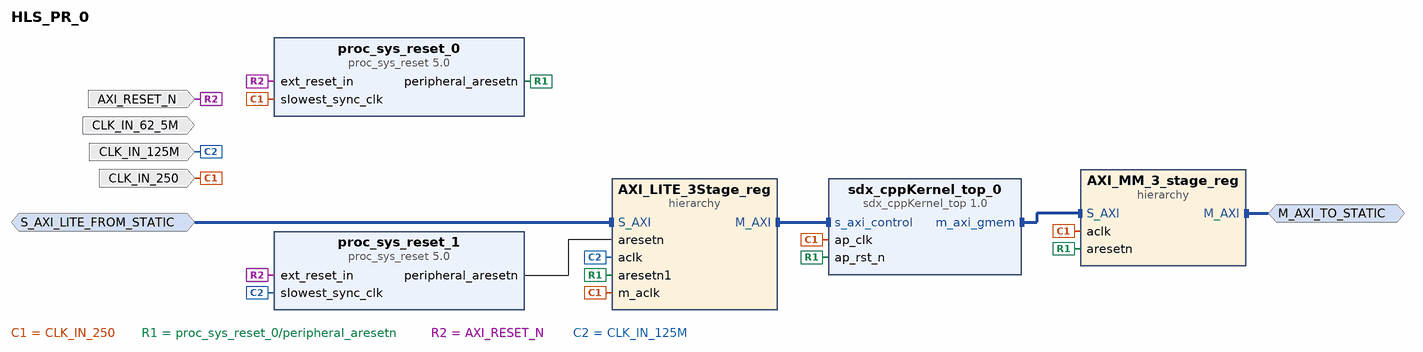
[diagram p0: block diagram of the top level]
# Vivado block design HLS_PR_0, xcvu9p-flgb2104-2-i, Vivado 2017.1_sdx
create_bd_design HLS_PR_0

create_bd_intf_port -mode Slave -vlnv xilinx.com:interface:aximm_rtl:1.0 S_AXI_LITE_FROM_STATIC
set_property -dict [list \
  CONFIG.DATA_WIDTH 32 \
  CONFIG.PROTOCOL AXI4LITE \
  CONFIG.FREQ_HZ 250000000 \
  CONFIG.ID_WIDTH 0 \
  CONFIG.ADDR_WIDTH 32 \
  CONFIG.AWUSER_WIDTH 0 \
  CONFIG.ARUSER_WIDTH 0 \
  CONFIG.WUSER_WIDTH 0 \
  CONFIG.RUSER_WIDTH 0 \
  CONFIG.BUSER_WIDTH 0 \
  CONFIG.READ_WRITE_MODE READ_WRITE \
  CONFIG.HAS_BURST 0 \
  CONFIG.HAS_LOCK 0 \
  CONFIG.HAS_PROT 1 \
  CONFIG.HAS_CACHE 0 \
  CONFIG.HAS_QOS 0 \
  CONFIG.HAS_REGION 0 \
  CONFIG.HAS_WSTRB 1 \
  CONFIG.HAS_BRESP 1 \
  CONFIG.HAS_RRESP 1 \
  CONFIG.SUPPORTS_NARROW_BURST 0 \
  CONFIG.NUM_READ_OUTSTANDING 1 \
  CONFIG.NUM_WRITE_OUTSTANDING 1 \
  CONFIG.MAX_BURST_LENGTH 1 \
  CONFIG.CLK_DOMAIN PCIe_Bridge_ICAP_complex_xdma_0_0_axi_aclk \
  CONFIG.NUM_READ_THREADS 1 \
  CONFIG.NUM_WRITE_THREADS 1 \
  CONFIG.RUSER_BITS_PER_BYTE 0 \
  CONFIG.WUSER_BITS_PER_BYTE 0 \
] [get_bd_intf_ports S_AXI_LITE_FROM_STATIC]
create_bd_intf_port -mode Master -vlnv xilinx.com:interface:aximm_rtl:1.0 M_AXI_TO_STATIC
set_property -dict [list \
  CONFIG.DATA_WIDTH 512 \
  CONFIG.PROTOCOL AXI4 \
  CONFIG.FREQ_HZ 250000000 \
  CONFIG.ADDR_WIDTH 32 \
  CONFIG.CLK_DOMAIN PCIe_Bridge_ICAP_complex_xdma_0_0_axi_aclk \
] [get_bd_intf_ports M_AXI_TO_STATIC]
create_bd_port -dir I -type clk CLK_IN_62_5M
set_property -dict [list \
  CONFIG.FREQ_HZ 250000000 \
  CONFIG.CLK_DOMAIN PCIe_Bridge_ICAP_complex_xdma_0_0_axi_aclk \
] [get_bd_ports CLK_IN_62_5M]
create_bd_port -dir I -type clk CLK_IN_250
set_property -dict [list \
  CONFIG.FREQ_HZ 250000000 \
  CONFIG.CLK_DOMAIN PCIe_Bridge_ICAP_complex_xdma_0_0_axi_aclk \
  CONFIG.ASSOCIATED_BUSIF M_AXI_TO_STATIC \
  CONFIG.ASSOCIATED_RESET AXI_RESET_N \
] [get_bd_ports CLK_IN_250]
create_bd_port -dir I -type rst AXI_RESET_N
create_bd_port -dir I -type clk CLK_IN_125M
set_property -dict [list \
  CONFIG.FREQ_HZ 250000000 \
  CONFIG.CLK_DOMAIN PCIe_Bridge_ICAP_complex_xdma_0_0_axi_aclk \
  CONFIG.ASSOCIATED_BUSIF S_AXI_LITE_FROM_STATIC \
] [get_bd_ports CLK_IN_125M]

create_bd_cell -type hier AXI_LITE_3Stage_reg
create_bd_cell -type hier AXI_MM_3_stage_reg
create_bd_cell -type ip -vlnv xilinx.com:ip:proc_sys_reset:5.0 proc_sys_reset_0
create_bd_cell -type ip -vlnv xilinx.com:ip:proc_sys_reset:5.0 proc_sys_reset_1
create_bd_cell -type ip -vlnv xilinx.com:hls:sdx_cppKernel_top:1.0 sdx_cppKernel_top_0

# ---- hierarchy /AXI_LITE_3Stage_reg ----
current_bd_instance /AXI_LITE_3Stage_reg
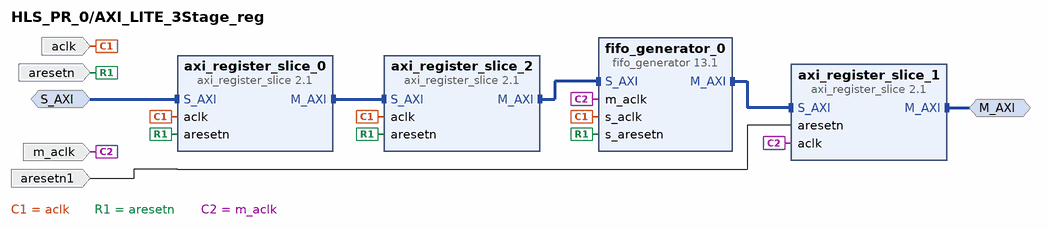
[diagram p1: block diagram inside /AXI_LITE_3Stage_reg]
create_bd_intf_pin -mode Slave -vlnv xilinx.com:interface:aximm_rtl:1.0 S_AXI
create_bd_intf_pin -mode Master -vlnv xilinx.com:interface:aximm_rtl:1.0 M_AXI
create_bd_pin -dir I -type clk aclk
create_bd_pin -dir I -type rst aresetn
create_bd_pin -dir I -type clk m_aclk
create_bd_pin -dir I -type rst aresetn1

create_bd_cell -type ip -vlnv xilinx.com:ip:axi_register_slice:2.1 axi_register_slice_0
set_property -dict {CONFIG.REG_R 7 CONFIG.REG_W 7} [get_bd_cells axi_register_slice_0]
create_bd_cell -type ip -vlnv xilinx.com:ip:axi_register_slice:2.1 axi_register_slice_1
set_property -dict {CONFIG.REG_R 7 CONFIG.REG_W 7} [get_bd_cells axi_register_slice_1]
create_bd_cell -type ip -vlnv xilinx.com:ip:axi_register_slice:2.1 axi_register_slice_2
set_property -dict {CONFIG.REG_R 7 CONFIG.REG_W 7} [get_bd_cells axi_register_slice_2]
create_bd_cell -type ip -vlnv xilinx.com:ip:fifo_generator:13.1 fifo_generator_0
set_property -dict [list \
  CONFIG.INTERFACE_TYPE AXI_MEMORY_MAPPED \
  CONFIG.PROTOCOL AXI4_Lite \
  CONFIG.Clock_Type_AXI Independent_Clock \
  CONFIG.DATA_WIDTH 32 \
  CONFIG.FIFO_Implementation_wach Independent_Clocks_Distributed_RAM \
  CONFIG.FIFO_Implementation_wdch Independent_Clocks_Builtin_FIFO \
  CONFIG.FIFO_Implementation_wrch Independent_Clocks_Distributed_RAM \
  CONFIG.FIFO_Implementation_rach Independent_Clocks_Distributed_RAM \
  CONFIG.FIFO_Implementation_rdch Independent_Clocks_Builtin_FIFO \
  CONFIG.FIFO_Implementation_axis Independent_Clocks_Builtin_FIFO \
] [get_bd_cells fifo_generator_0]

# ---- hierarchy /AXI_MM_3_stage_reg ----
current_bd_instance /AXI_MM_3_stage_reg
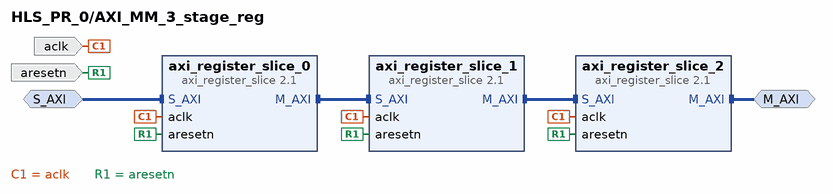
[diagram p2: block diagram inside /AXI_MM_3_stage_reg]
create_bd_intf_pin -mode Slave -vlnv xilinx.com:interface:aximm_rtl:1.0 S_AXI
create_bd_intf_pin -mode Master -vlnv xilinx.com:interface:aximm_rtl:1.0 M_AXI
create_bd_pin -dir I -type clk aclk
create_bd_pin -dir I -type rst aresetn

create_bd_cell -type ip -vlnv xilinx.com:ip:axi_register_slice:2.1 axi_register_slice_0
create_bd_cell -type ip -vlnv xilinx.com:ip:axi_register_slice:2.1 axi_register_slice_1
create_bd_cell -type ip -vlnv xilinx.com:ip:axi_register_slice:2.1 axi_register_slice_2

# ---- connections ----

current_bd_instance /AXI_LITE_3Stage_reg
connect_bd_intf_net [get_bd_intf_pins axi_register_slice_0/M_AXI] [get_bd_intf_pins axi_register_slice_2/S_AXI]
connect_bd_intf_net [get_bd_intf_pins fifo_generator_0/S_AXI] [get_bd_intf_pins axi_register_slice_2/M_AXI]
connect_bd_intf_net [get_bd_intf_pins fifo_generator_0/M_AXI] [get_bd_intf_pins axi_register_slice_1/S_AXI]
connect_bd_intf_net [get_bd_intf_pins S_AXI] [get_bd_intf_pins axi_register_slice_0/S_AXI]
connect_bd_intf_net [get_bd_intf_pins M_AXI] [get_bd_intf_pins axi_register_slice_1/M_AXI]
connect_bd_net [get_bd_pins aclk] \
  [get_bd_pins axi_register_slice_0/aclk] [get_bd_pins axi_register_slice_2/aclk] [get_bd_pins fifo_generator_0/s_aclk]
connect_bd_net [get_bd_pins aresetn] \
  [get_bd_pins axi_register_slice_0/aresetn] [get_bd_pins axi_register_slice_2/aresetn] \
  [get_bd_pins fifo_generator_0/s_aresetn]
connect_bd_net [get_bd_pins m_aclk] [get_bd_pins axi_register_slice_1/aclk] [get_bd_pins fifo_generator_0/m_aclk]
connect_bd_net -net aresetn1_1 [get_bd_pins aresetn1] [get_bd_pins axi_register_slice_1/aresetn]

current_bd_instance /AXI_MM_3_stage_reg
connect_bd_intf_net [get_bd_intf_pins axi_register_slice_1/S_AXI] [get_bd_intf_pins axi_register_slice_0/M_AXI]
connect_bd_intf_net [get_bd_intf_pins axi_register_slice_2/S_AXI] [get_bd_intf_pins axi_register_slice_1/M_AXI]
connect_bd_intf_net [get_bd_intf_pins S_AXI] [get_bd_intf_pins axi_register_slice_0/S_AXI]
connect_bd_intf_net [get_bd_intf_pins M_AXI] [get_bd_intf_pins axi_register_slice_2/M_AXI]
connect_bd_net -net axi_pcie3_0_axi_aclk [get_bd_pins aclk] \
  [get_bd_pins axi_register_slice_0/aclk] [get_bd_pins axi_register_slice_1/aclk] [get_bd_pins axi_register_slice_2/aclk]
connect_bd_net -net axi_pcie3_0_axi_aresetn [get_bd_pins aresetn] \
  [get_bd_pins axi_register_slice_0/aresetn] [get_bd_pins axi_register_slice_1/aresetn] \
  [get_bd_pins axi_register_slice_2/aresetn]

current_bd_instance /
connect_bd_intf_net [get_bd_intf_pins AXI_MM_3_stage_reg/S_AXI] [get_bd_intf_pins sdx_cppKernel_top_0/m_axi_gmem]
connect_bd_intf_net [get_bd_intf_pins sdx_cppKernel_top_0/s_axi_control] [get_bd_intf_pins AXI_LITE_3Stage_reg/M_AXI]
connect_bd_intf_net [get_bd_intf_ports S_AXI_LITE_FROM_STATIC] [get_bd_intf_pins AXI_LITE_3Stage_reg/S_AXI]
connect_bd_intf_net [get_bd_intf_ports M_AXI_TO_STATIC] [get_bd_intf_pins AXI_MM_3_stage_reg/M_AXI]
connect_bd_net -net aclk_1 [get_bd_ports CLK_IN_250] \
  [get_bd_pins AXI_MM_3_stage_reg/aclk] [get_bd_pins AXI_LITE_3Stage_reg/m_aclk] \
  [get_bd_pins proc_sys_reset_0/slowest_sync_clk] [get_bd_pins sdx_cppKernel_top_0/ap_clk]
connect_bd_net -net aresetn_1 [get_bd_pins proc_sys_reset_0/peripheral_aresetn] \
  [get_bd_pins AXI_MM_3_stage_reg/aresetn] [get_bd_pins AXI_LITE_3Stage_reg/aresetn1] \
  [get_bd_pins sdx_cppKernel_top_0/ap_rst_n]
connect_bd_net [get_bd_ports AXI_RESET_N] [get_bd_pins proc_sys_reset_0/ext_reset_in] [get_bd_pins proc_sys_reset_1/ext_reset_in]
connect_bd_net [get_bd_ports CLK_IN_125M] [get_bd_pins AXI_LITE_3Stage_reg/aclk] [get_bd_pins proc_sys_reset_1/slowest_sync_clk]
connect_bd_net [get_bd_pins proc_sys_reset_1/peripheral_aresetn] [get_bd_pins AXI_LITE_3Stage_reg/aresetn]

# ---- address map ----
assign_bd_address -offset 0x00000000 -range 64K -target_address_space [get_bd_addr_spaces S_AXI_LITE_FROM_STATIC] [get_bd_addr_segs sdx_cppKernel_top_0/s_axi_control/Reg]
assign_bd_address -offset 0x00000000 -range 2G -target_address_space [get_bd_addr_spaces sdx_cppKernel_top_0/Data_m_axi_gmem] [get_bd_addr_segs M_AXI_TO_STATIC/Reg]

validate_bd_design
save_bd_design
